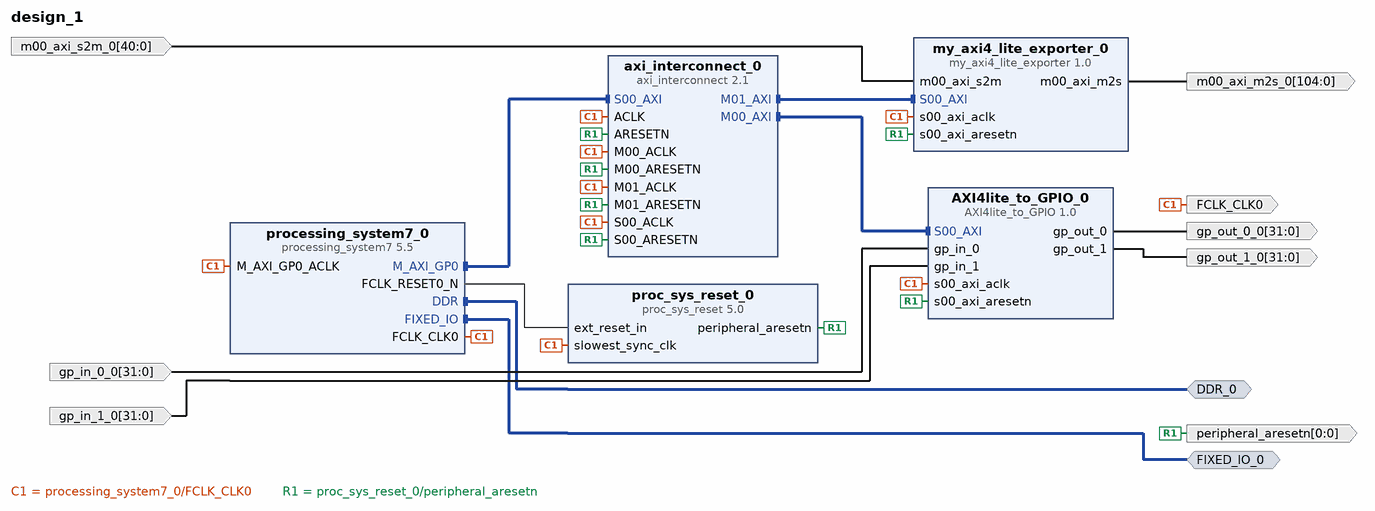
[diagram p0: block diagram of the top level]
# Vivado block design design_1, xc7z020clg400-1, Vivado 2020.2
create_bd_design design_1

create_bd_intf_port -mode Master -vlnv xilinx.com:interface:ddrx_rtl:1.0 DDR_0
create_bd_intf_port -mode Master -vlnv xilinx.com:display_processing_system7:fixedio_rtl:1.0 FIXED_IO_0
create_bd_port -dir I -from 31 -to 0 gp_in_0_0
create_bd_port -dir I -from 31 -to 0 gp_in_1_0
create_bd_port -dir O -from 31 -to 0 gp_out_0_0
create_bd_port -dir O -from 31 -to 0 gp_out_1_0
create_bd_port -dir O -type clk FCLK_CLK0
create_bd_port -dir O -from 0 -to 0 -type rst peripheral_aresetn
create_bd_port -dir O -from 104 -to 0 m00_axi_m2s_0
create_bd_port -dir I -from 40 -to 0 m00_axi_s2m_0

create_bd_cell -type ip -vlnv xilinx.com:ip:processing_system7:5.5 processing_system7_0
set_property -dict [list \
  CONFIG.PCW_APU_PERIPHERAL_FREQMHZ 666.666666 \
  CONFIG.PCW_ENET0_PERIPHERAL_ENABLE 0 \
  CONFIG.PCW_FPGA0_PERIPHERAL_FREQMHZ 50 \
  CONFIG.PCW_FPGA1_PERIPHERAL_FREQMHZ 50 \
  CONFIG.PCW_GPIO_MIO_GPIO_ENABLE 0 \
  CONFIG.PCW_PRESET_BANK1_VOLTAGE {LVCMOS 3.3V} \
  CONFIG.PCW_QSPI_PERIPHERAL_ENABLE 0 \
  CONFIG.PCW_SD0_PERIPHERAL_ENABLE 0 \
  CONFIG.PCW_UART1_PERIPHERAL_ENABLE 0 \
  CONFIG.PCW_UIPARAM_DDR_PARTNO {MT41J128M8 JP-125} \
  CONFIG.PCW_USB0_PERIPHERAL_ENABLE 0 \
] [get_bd_cells processing_system7_0]
# 118 more settings of processing_system7_0 are not shown: defaults, MIO pin electricals, DDR timing, and values the tool derives
create_bd_cell -type ip -vlnv xilinx.com:ip:axi_interconnect:2.1 axi_interconnect_0
set_property -dict {CONFIG.NUM_MI 2} [get_bd_cells axi_interconnect_0]
create_bd_cell -type ip -vlnv xilinx.com:ip:proc_sys_reset:5.0 proc_sys_reset_0
create_bd_cell -type ip -vlnv user.org:user:AXI4lite_to_GPIO:1.0 AXI4lite_to_GPIO_0
create_bd_cell -type ip -vlnv user.org:user:my_axi4_lite_exporter:1.0 my_axi4_lite_exporter_0

# ---- connections ----

connect_bd_intf_net [get_bd_intf_pins processing_system7_0/M_AXI_GP0] [get_bd_intf_pins axi_interconnect_0/S00_AXI]
connect_bd_intf_net [get_bd_intf_ports DDR_0] [get_bd_intf_pins processing_system7_0/DDR]
connect_bd_intf_net [get_bd_intf_pins AXI4lite_to_GPIO_0/S00_AXI] [get_bd_intf_pins axi_interconnect_0/M00_AXI]
connect_bd_intf_net [get_bd_intf_ports FIXED_IO_0] [get_bd_intf_pins processing_system7_0/FIXED_IO]
connect_bd_intf_net [get_bd_intf_pins axi_interconnect_0/M01_AXI] [get_bd_intf_pins my_axi4_lite_exporter_0/S00_AXI]
connect_bd_net [get_bd_pins processing_system7_0/FCLK_CLK0] \
  [get_bd_pins axi_interconnect_0/ACLK] [get_bd_pins proc_sys_reset_0/slowest_sync_clk] \
  [get_bd_pins axi_interconnect_0/S00_ACLK] [get_bd_pins processing_system7_0/M_AXI_GP0_ACLK] \
  [get_bd_pins axi_interconnect_0/M00_ACLK] [get_bd_pins AXI4lite_to_GPIO_0/s00_axi_aclk] [get_bd_ports FCLK_CLK0] \
  [get_bd_pins axi_interconnect_0/M01_ACLK] [get_bd_pins my_axi4_lite_exporter_0/s00_axi_aclk]
connect_bd_net [get_bd_pins proc_sys_reset_0/peripheral_aresetn] \
  [get_bd_pins axi_interconnect_0/ARESETN] [get_bd_pins axi_interconnect_0/S00_ARESETN] \
  [get_bd_pins axi_interconnect_0/M00_ARESETN] [get_bd_pins AXI4lite_to_GPIO_0/s00_axi_aresetn] \
  [get_bd_ports peripheral_aresetn] [get_bd_pins axi_interconnect_0/M01_ARESETN] \
  [get_bd_pins my_axi4_lite_exporter_0/s00_axi_aresetn]
connect_bd_net [get_bd_pins processing_system7_0/FCLK_RESET0_N] [get_bd_pins proc_sys_reset_0/ext_reset_in]
connect_bd_net -net gp_in_0_0_1 [get_bd_ports gp_in_0_0] [get_bd_pins AXI4lite_to_GPIO_0/gp_in_0]
connect_bd_net -net gp_in_1_0_1 [get_bd_ports gp_in_1_0] [get_bd_pins AXI4lite_to_GPIO_0/gp_in_1]
connect_bd_net [get_bd_pins AXI4lite_to_GPIO_0/gp_out_0] [get_bd_ports gp_out_0_0]
connect_bd_net [get_bd_pins AXI4lite_to_GPIO_0/gp_out_1] [get_bd_ports gp_out_1_0]
connect_bd_net [get_bd_pins my_axi4_lite_exporter_0/m00_axi_m2s] [get_bd_ports m00_axi_m2s_0]
connect_bd_net -net m00_axi_s2m_0_1 [get_bd_ports m00_axi_s2m_0] [get_bd_pins my_axi4_lite_exporter_0/m00_axi_s2m]

# ---- address map ----
assign_bd_address -offset 0x43C00000 -range 64K -target_address_space [get_bd_addr_spaces processing_system7_0/Data] [get_bd_addr_segs AXI4lite_to_GPIO_0/S00_AXI/S00_AXI_reg]
assign_bd_address -offset 0x43C10000 -range 64K -target_address_space [get_bd_addr_spaces processing_system7_0/Data] [get_bd_addr_segs my_axi4_lite_exporter_0/S00_AXI/S00_AXI_reg]

validate_bd_design
save_bd_design
